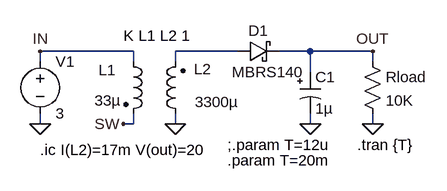
[diagram p0: schematic FlyBackRevers.asc]
FlyBackRevers.asc, the LTspice schematic file:
Version 4
SHEET 1 2376 1416
WIRE 1664 832 1520 832
WIRE 1824 832 1728 832
WIRE 1936 832 1888 832
WIRE 2032 832 1936 832
WIRE 1520 848 1520 832
WIRE 1664 848 1664 832
WIRE 1728 848 1728 832
WIRE 2032 848 2032 832
WIRE 1936 864 1936 832
WIRE 1520 944 1520 928
WIRE 1664 944 1664 928
WIRE 1664 944 1648 944
WIRE 1728 944 1728 928
WIRE 1936 944 1936 928
WIRE 2032 944 2032 928
FLAG 2032 832 OUT
FLAG 1936 944 0
FLAG 2032 944 0
FLAG 1520 944 0
FLAG 1520 832 IN
FLAG 1728 944 0
FLAG 1648 944 SW
SYMBOL VOLTAGE 1520 832 R0
WINDOW 123 0 0 Left 0
SYMATTR InstName V1
SYMATTR Value 3
SYMATTR SpiceLine Rser=0.1
SYMBOL POLCAP 1920 864 R0
SYMATTR InstName C1
SYMATTR Value 1µ
SYMATTR SpiceLine Rser=0.02
SYMBOL schottky 1824 848 R270
WINDOW 0 32 32 VTop 0
WINDOW 3 0 46 VBottom 0
SYMATTR InstName D1
SYMATTR Value MBRS140
SYMBOL ind2 1648 832 R0
WINDOW 0 -38 29 Left 0
WINDOW 3 -44 76 Left 0
SYMATTR InstName L1
SYMATTR Value 33µ
SYMATTR SpiceLine Rser=0.02 Rpar=5000
SYMATTR Type ind
SYMBOL res 2016 832 R0
SYMATTR InstName Rload
SYMATTR Value 10K
SYMBOL ind2 1744 944 R180
WINDOW 0 -40 85 Left 0
WINDOW 3 -82 34 Left 0
SYMATTR InstName L2
SYMATTR Value 3300µ
SYMATTR Type ind
TEXT 2008 976 Left 0 !.tran {T}
TEXT 1648 808 Left 0 !K L1 L2 1
TEXT 1520 984 Left 0 !.ic I(L2)=17m V(out)=20
TEXT 1808 976 Left 0 !;.param T=12u
TEXT 1808 1000 Left 0 !.param T=20m

The netlist it stands for:
* FlyBackRevers.asc
V1 IN 0 3 Rser=0.1
C1 OUT 0 1µ Rser=0.02
D1 N001 OUT MBRS140
L1 IN SW 33µ Rser=0.02 Rpar=5000
Rload OUT 0 10K
L2 0 N001 3300µ
.model D D
.lib standard.dio
.tran {T}
K L1 L2 1
.ic I(L2)=17m V(out)=20
;.param T=12u
.param T=20m
.backanno
.end